# EAGLE design BREAKOUT328 (EAGLE 8.5.0)
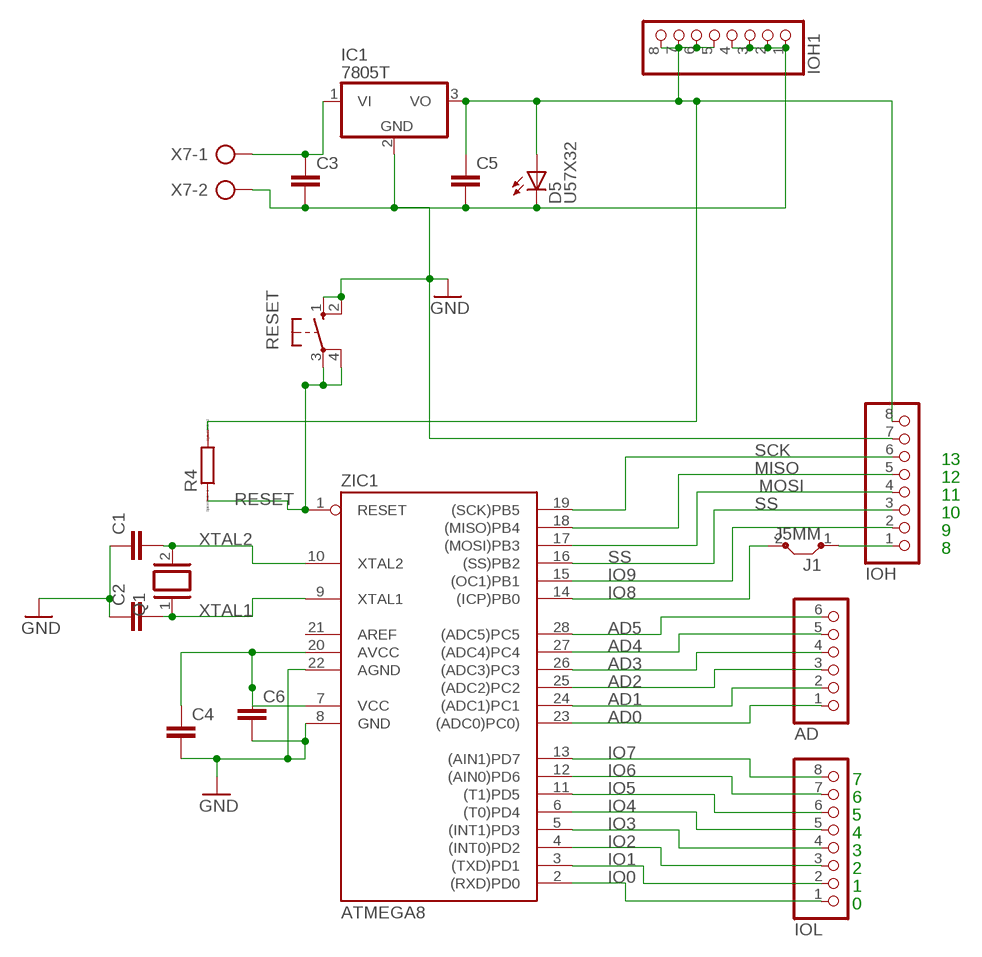
[diagram p0: schematic, sheet 1]

## Parts
AD  PINHD-1X6  [1X06]
C1  C2.5/6  [C2.5-6]
C2  C2.5/6  [C2.5-6]
C3  C2.5/4  [C2.5-4]
C4  C2.5/4  [C2.5-4]
C5  C2.5/4  [C2.5-4]
C6  C2.5/4  [C2.5-4]
D5  U57X32  [U57X32]
IC1  7805T  [TO220H]
IOH  PINHD-1X8  [1X08]
IOH1  PINHD-1X8  [1X08]
IOL  PINHD-1X8  [1X08]
J1  J5MM  [05]
Q1  XTAL/S  [QS]
R4  R0207/10  [0207/10]
RESET  10-XX  [B3F-10XX]
X7  AK500/2-H  [AK500/2-H]
ZIC1  ATMEGA8  AT90S4433P  [DIL28-3]

## Nets
AD0: AD.1 ZIC1.23((ADC0)PC0))
AD1: AD.2 ZIC1.24((ADC1)PC1)
AD2: AD.3 ZIC1.25((ADC2)PC2)
AD3: AD.4 ZIC1.26((ADC3)PC3)
AD4: AD.5 ZIC1.27((ADC4)PC4)
AD5: AD.6 ZIC1.28((ADC5)PC5)
GND: C1.1 C2.1 C3.2 C4.2 C5.2 C6.2 D5.K(C) IC1.2(GND) IOH1.1 IOH1.2 IOH1.3 IOH1.4 IOH.7 RESET.1(S) RESET.2(S1) X7.2 ZIC1.8(GND) ZIC1.22(AGND)
IO0: IOL.1 ZIC1.2((RXD)PD0)
IO1: IOL.2 ZIC1.3((TXD)PD1)
IO2: IOL.3 ZIC1.4((INT0)PD2)
IO3: IOL.4 ZIC1.5((INT1)PD3)
IO4: IOL.5 ZIC1.6((T0)PD4)
IO5: IOL.6 ZIC1.11((T1)PD5)
IO6: IOL.7 ZIC1.12((AIN0)PD6)
IO7: IOL.8 ZIC1.13((AIN1)PD7)
IO8: J1.2 ZIC1.14((ICP)PB0)
IO9: IOH.2 ZIC1.15((OC1)PB1)
MISO: IOH.5 ZIC1.18((MISO)PB4)
MOSI: IOH.4 ZIC1.17((MOSI)PB3)
N$1: IOH.1 J1.1
N$15: C3.1 IC1.1(VI) X7.1
RESET: R4.1 RESET.3(P) RESET.4(P1) ZIC1.1(RESET)
SCK: IOH.6 ZIC1.19((SCK)PB5)
SS: IOH.3 ZIC1.16((SS)PB2)
VCC: C4.1 C5.1 C6.1 D5.A IC1.3(VO) IOH1.5 IOH1.6 IOH1.7 IOH1.8 IOH.8 R4.2 ZIC1.7(VCC) ZIC1.20(AVCC)
XTAL1: C2.2 Q1.1 ZIC1.9(XTAL1)
XTAL2: C1.2 Q1.2 ZIC1.10(XTAL2)
Unconnected: ZIC1.21(AREF)

## Notes on the sheet
- 13
- 12
- 11
- 10
- 9
- 8
- 7
- 6
- 5
- 4
- 3
- 2
- 1
- 0

## Library data of the parts
AD = pinhead:PINHD-1X6: PIN HEADER
C1-C6 = capacitor-wima:C: CAPACITOR naming: grid - package width
D5 = led:U57X32: LED rectangle, 5.7 x 3.2 mm
IC1 = linear:78*: Positive VOLTAGE REGULATOR Source: http://cache.national.com/ds/LM/LM78L05.pdf http://www.fairchildsemi.com/ds/LM/LM7805.pdf
IOH IOH1 IOL = pinhead:PINHD-1X8: PIN HEADER
J1 = jumper:J: Bridge
Q1 = special:XTAL/S: CRYSTAL
R4 = eagle-ltspice:R: RESISTOR, European symbol; SPICEMODEL: NONE; SPICEPREFIX: R
RESET = switch-omron:10-XX: OMRON SWITCH; MPN: B3F-1000; OC_FARNELL: 176432; OC_NEWARK: 36M3542
X7 = con-ptr500:AK500/2-H: CONNECTOR Aug. 2004 / PTR Meßtechnik: Die Bezeichnung der Serie AK505 wurde geändert. Es handelt sich hierbei um AK500 in horizontaler Ausführung.; OC_FARNELL: unknown; OC_NEWARK: unknown
ZIC1 = atmel:AT90S4433: MICROCONTROLLER 4 Kbytes FLASH 128 bytes SRAM 256 bytes EEPROM UART 6-channel 10 bit ADC

## Board
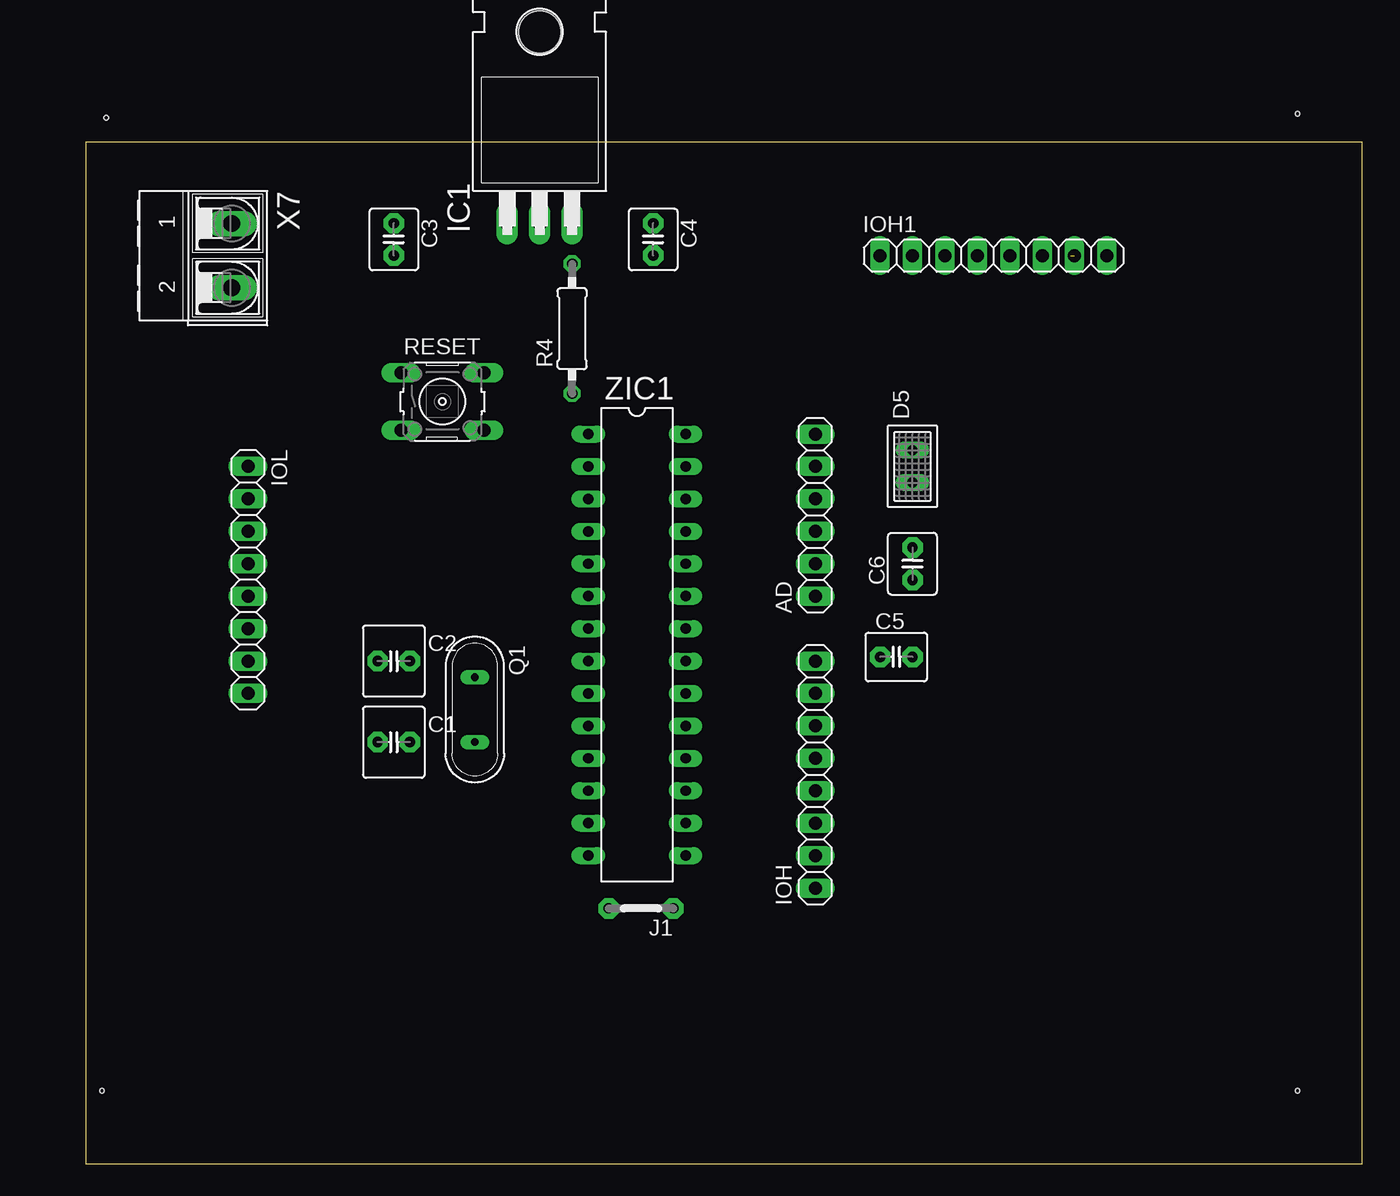
[diagram p1: board, top side]
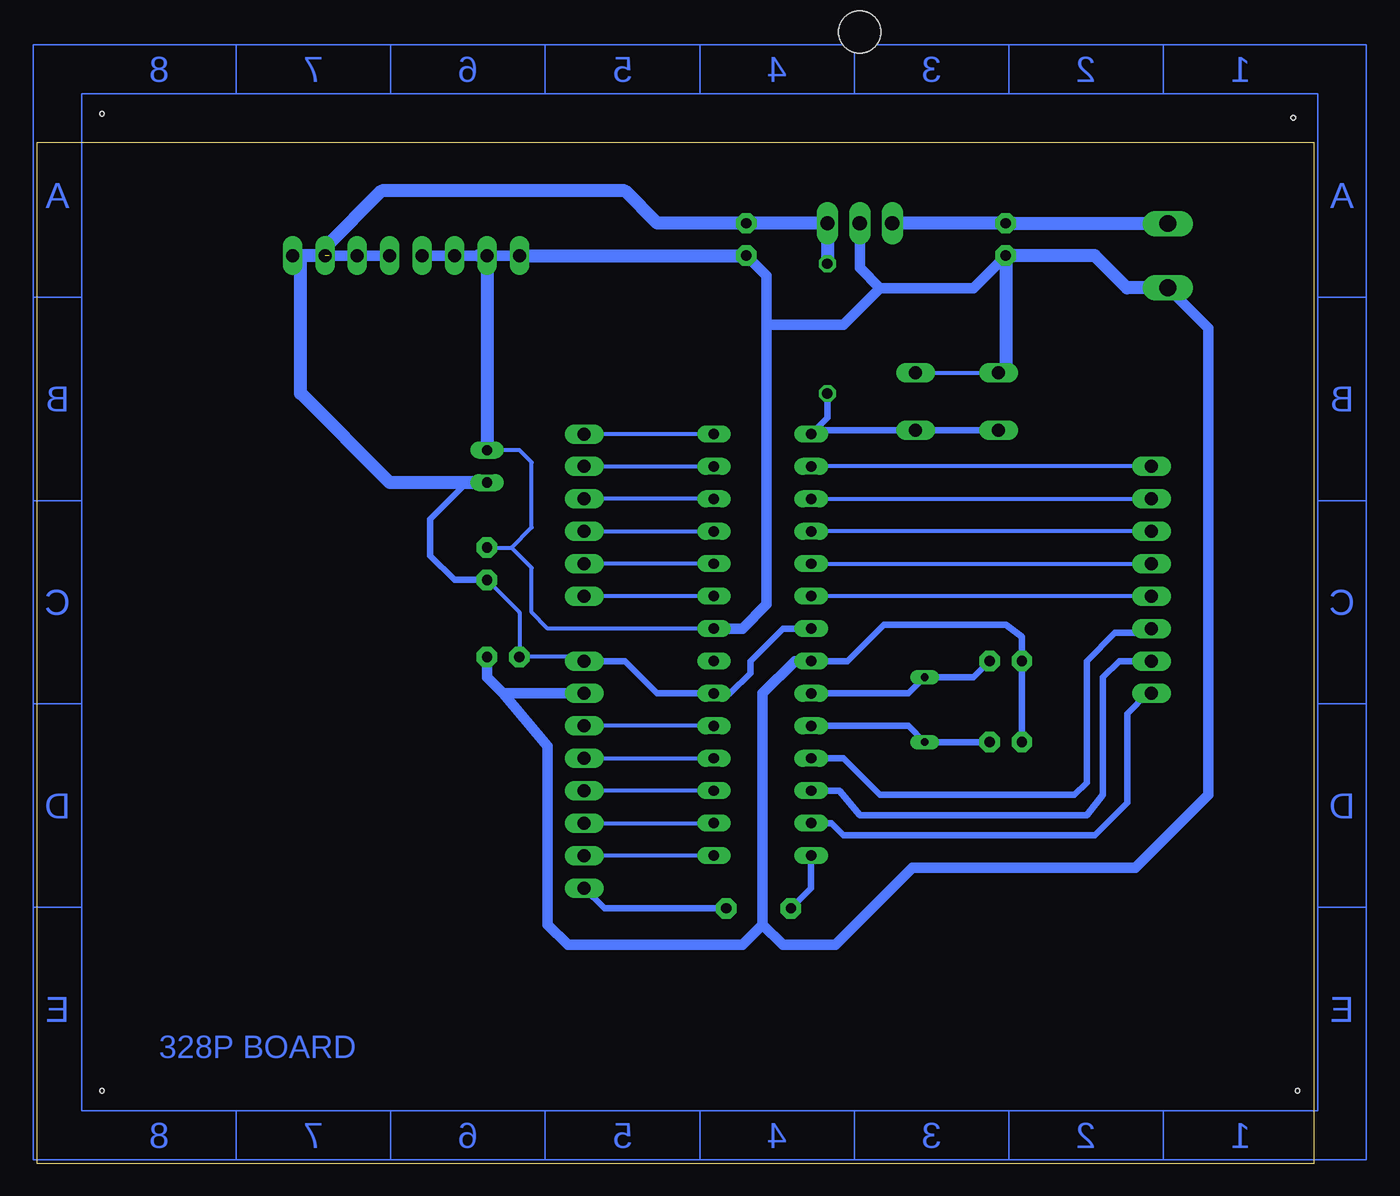
[diagram p2: board, bottom side, seen from below]

Size 100 x 80 mm. Coordinates in mm from the lower left corner, seen from the top.
Outline: 0,0 100,0 100,80 0,80 0,0
Copper layers (1*16): Top 0.035mm / dielectric 1.5mm / Bottom 0.035mm
Design rules "default": minimum track width 6mil, minimum drill 0.35mm, track to track 6mil, track to pad 6mil, pad to pad 6mil, via to via 6mil, smd to smd 6mil, copper to edge 40mil, drill to drill 6mil, minimum pad ring 10mil, minimum via ring 8mil, stop-mask expansion 4mil, vias tented up to drill 0mil, thermal gap 10mil
Holes 0.35 mm at 1.59,81.92 94.93,82.23 94.93,5.71 1.27,5.71

### Footprints (pad centres in the part's own frame; a part is rotated, then mirrored left to right if it is on the bottom)
1X06 = drill 1.016 long: 1 -6.35,0; 2 -3.81,0; 3 -1.27,0; 4 1.27,0; 5 3.81,0; 6 6.35,0
C2.5-6 = drill 0.813 pad 1.6 octagon: 1 -1.27,0; 2 1.27,0
C2.5-4 = drill 0.813 pad 1.6 octagon: 1 -1.27,0; 2 1.27,0
U57X32 = drill 0.813 long: A -1.27,0; K 1.27,0
TO220H = drill 1.118 long: 1 -2.54,-10.16; 2 0,-10.16; 3 2.54,-10.16 | hole 3.302: 0,4.826
1X08 = drill 1.016 long: 1 -8.89,0; 2 -6.35,0; 3 -3.81,0; 4 -1.27,0; 5 1.27,0; 6 3.81,0; 7 6.35,0; 8 8.89,0
05 = drill 0.813 pad 1.6 octagon: 1 -2.54,0; 2 2.54,0
QS = drill 0.61 long: 1 -2.54,0; 2 2.54,0
0207/10 = drill 0.813 octagon: 1 -5.08,0; 2 5.08,0
B3F-10XX = drill 1.016 long: 1 -3.251,2.261; 2 3.251,2.261; 3 -3.251,-2.261; 4 3.251,-2.261
AK500/2-H = drill 1.321 long: 1 -2.515,0; 2 2.515,0
DIL28-3 = drill 0.813 long: 1 -16.51,-3.81; 2 -13.97,-3.81; 3 -11.43,-3.81; 4 -8.89,-3.81; 5 -6.35,-3.81; 6 -3.81,-3.81; 7 -1.27,-3.81; 8 1.27,-3.81; 9 3.81,-3.81; 10 6.35,-3.81; 11 8.89,-3.81; 12 11.43,-3.81; 13 13.97,-3.81; 14 16.51,-3.81; 15 16.51,3.81; 16 13.97,3.81; 17 11.43,3.81; 18 8.89,3.81; 19 6.35,3.81; 20 3.81,3.81; 21 1.27,3.81; 22 -1.27,3.81; 23 -3.81,3.81; 24 -6.35,3.81; 25 -8.89,3.81; 26 -11.43,3.81; 27 -13.97,3.81; 28 -16.51,3.81

### Placement (x,y rotation side)
AD  57.15,50.8 90 top
C1  24.13,33.02 0 top
C2  24.13,39.37 0 top
C3  24.13,72.39 270 top
C4  44.45,72.39 270 top
C5  63.5,39.69 0 top
C6  64.77,46.99 90 top
D5  64.77,54.61 90 top
IC1  35.56,83.82 0 top
IOH  57.15,30.48 90 top
IOH1  71.12,71.12 0 top
IOL  12.7,45.72 270 top
J1  43.5,20 180 top
Q1  30.48,35.56 270 top
R4  38.1,65.41 90 top
RESET  27.94,59.69 0 top
X7  11.43,71.12 270 top
ZIC1  43.18,40.64 270 top

### Tracks (layer width: path | path; a pad name or v marks a point on that pad's centre or on a via)
AD0
  Bottom 0.305: ZIC1.23 AD.1
AD1
  Bottom 0.305: ZIC1.24 AD.2
AD2
  Bottom 0.305: AD.3 ZIC1.25
AD3
  Bottom 0.305: ZIC1.26 AD.4
AD4
  Bottom 0.305: AD.5 ZIC1.27
AD5
  Bottom 0.305: ZIC1.28 AD.6
GND
  Bottom 0.305: RESET.2 RESET.1 | C6.2 62.87,48.26 | 62.87,48.26 61.28,49.85 61.28,54.93 62.23,55.88 D5.K | 62.87,48.26 61.28,46.67 61.28,43.18 60.01,41.91 ZIC1.22
  Bottom 0.508: ZIC1.8 36.51,39.37 33.66,42.23 24.13,42.23 22.86,41.27 C2.1 C1.1
  Bottom 0.813: ZIC1.8 40.64,39.37 43.18,36.83 43.18,18.73 | 43.18,18.73 44.77,17.14 58.42,17.14 60.01,18.73 60.01,32.7 63.5,36.83 | IOH.7 63.5,36.83 | 63.5,36.83 64.77,38.1 C5.2 | ZIC1.22 44.77,41.91 42.86,43.81 42.86,65.72 | C4.2 42.86,69.53 42.86,65.72 | C3.2 26.67,68.58 33.97,68.58 | IC1.2 35.56,70.17 33.97,68.58 | 33.97,68.58 36.83,65.72 42.86,65.72 | 43.18,18.73 41.59,17.14 37.47,17.14 31.43,23.18 13.97,23.18 8.26,28.89 8.26,65.43 X7.2 | IOH1.4 IOH1.3 65.41,71.12 | IOH1.1 IOH1.2
  Bottom 1.016: X7.2 14.63,68.61 17.14,71.12 C3.2 24.13,62.51 RESET.1 | 65.41,71.12 IOH1.2 D5.K | IOH1.1 C4.2
IO0
  Bottom 0.305: IOL.1 ZIC1.2
IO1
  Bottom 0.305: ZIC1.3 IOL.2
IO2
  Bottom 0.305: IOL.3 ZIC1.4
IO3
  Bottom 0.305: ZIC1.5 IOL.4
IO4
  Bottom 0.305: IOL.5 ZIC1.6
IO5
  Bottom 0.508: IOL.6 13.02,41.59 15.56,41.59 17.78,39.37 17.78,29.84 18.73,28.89 33.97,28.89 36.83,31.75 ZIC1.11
IO6
  Bottom 0.508: ZIC1.12 37.15,29.21 35.56,27.3 17.78,27.3 16.51,28.89 16.51,38.1 15.24,39.37 IOL.7
IO7
  Bottom 0.508: ZIC1.13 37.78,26.67 36.83,25.72 17.14,25.72 14.61,28.26 14.61,35.24 13.02,36.83 IOL.8
IO8
  Bottom 0.508: J1.2 39.37,21.59 ZIC1.14
IO9
  Bottom 0.305: ZIC1.15 IOH.2
MISO
  Bottom 0.305: IOH.5 ZIC1.18
MOSI
  Bottom 0.305: ZIC1.17 IOH.4
N$1
  Bottom 0.508: IOH.1 55.56,20 J1.1
N$15
  Bottom 1.016: X7.1 24.11,73.64 C3.1 IC1.1
RESET
  Bottom 0.508: RESET.3 RESET.4 39.09,57.43 ZIC1.1 38.1,58.42 R4.1
SCK
  Bottom 0.305: ZIC1.19 IOH.6
SS
  Bottom 0.305: IOH.3 ZIC1.16
VCC  (1 unrouted)
  Bottom 0.305: IOH.8 57.47,39.69 C5.1 62.23,43.18 C6.1
  Bottom 0.508: C6.1 67.31,45.72 69.22,47.62 69.22,50.48 66.36,53.34 D5.A | IOH.8 53.98,39.37 51.44,36.83 ZIC1.20 45.72,36.83 44.13,38.42 44.13,39.37 41.59,41.91 ZIC1.7
  Bottom 0.813: IOH1.5 IOH1.6 77.15,71.12 | IOH1.8 78.11,71.12
  Bottom 1.016: R4.2 IC1.3 C4.1 51.44,73.66 53.98,76.2 73.03,76.2 77.47,71.75 IOH1.7 | 77.15,71.12 78.11,71.12 79.38,71.12 | D5.A 72.39,53.34 79.38,60.33 79.38,71.12 | IOH1.8 79.38,71.12
XTAL1
  Bottom 0.508: C2.2 26.67,38.1 Q1.1 31.75,36.83 ZIC1.9
XTAL2
  Bottom 0.508: ZIC1.10 31.75,34.29 Q1.2 C1.2
(copper drawn outside any net)
  shapes: Bottom area x1

### Text on the board
Bottom: 328P BOARD